# Altium project Fleet-Monitor.PrjPcb
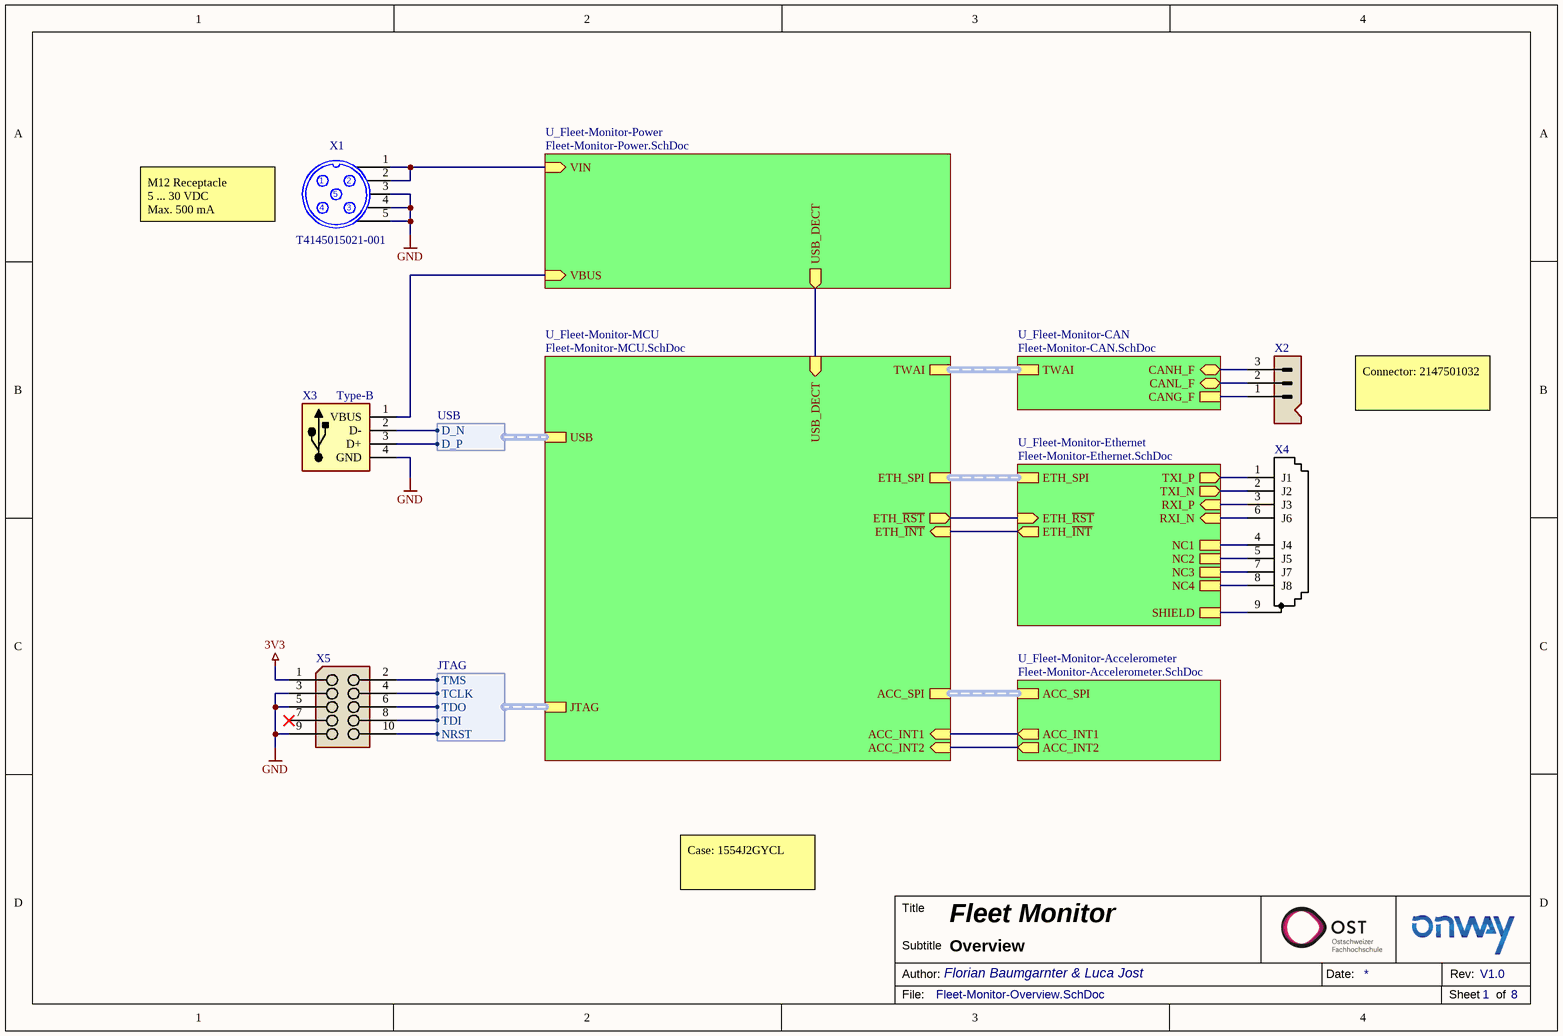
[diagram p0: Fleet-Monitor-Overview.SchDoc]
8 sheets, 116 parts. Net scope: hierarchical (ports join the sheet entries above them; power ports are global).
Sheets:
  Fleet-Monitor-Overview.SchDoc
    U_Fleet-Monitor-CAN = Fleet-Monitor-CAN.SchDoc
      U_Fleet-Monitor-CAN-Filter = Fleet-Monitor-CAN-Filter.SchDoc
    U_Fleet-Monitor-Ethernet = Fleet-Monitor-Ethernet.SchDoc
      U_Fleet-Monitor-Ethernet-Filter = Fleet-Monitor-Ethernet-Filter.SchDoc
    U_Fleet-Monitor-Accelerometer = Fleet-Monitor-Accelerometer.SchDoc
    U_Fleet-Monitor-Power = Fleet-Monitor-Power.SchDoc
    U_Fleet-Monitor-MCU = Fleet-Monitor-MCU.SchDoc

## Sheet Fleet-Monitor-Overview.SchDoc: Fleet Monitor
size A4; Subtitle: Overview; DocumentNumber: 1; Revision: V1.0; SheetNumber: 1; SheetTotal: 8; Author: Florian Baumgarnter & Luca Jost

### Parts
X1  T4145015021-001  [THT Connector M12]
X2  Pin Header Through Hole Wire To Board  [THT Connector 0436500315]  (value not drawn)
X3  Type-B  [THT Connector MUSBD111M5]
X4  NE8FDH-C5E-TOP  [THT Connector NE8FDH-C5E-TOP]  (value not drawn)
X5  JTAG-Header (ARM-Cortex)  [SMD Connector 1.27mm (2x5)]  (value not drawn)

### Sub-sheets
U_Fleet-Monitor-Accelerometer = Fleet-Monitor-Accelerometer.SchDoc: ACC_SPI (harness SPI), ACC_INT1 (out), ACC_INT2 (out)
U_Fleet-Monitor-CAN = Fleet-Monitor-CAN.SchDoc: TWAI (harness TWAI), CANH_F (bidir), CANL_F (bidir), CANG_F
U_Fleet-Monitor-Ethernet = Fleet-Monitor-Ethernet.SchDoc: NC1, ETH_SPI (harness SPI), TXI_P (out), TXI_N (out), RXI_P (in), RXI_N (in), ETH_~{RST} (in), ETH_~{INT} (out), NC2, NC3, NC4, SHIELD
U_Fleet-Monitor-MCU = Fleet-Monitor-MCU.SchDoc: USB (harness USB), JTAG (harness JTAG), ETH_SPI (harness SPI), TWAI (harness TWAI), ACC_INT1 (in), ACC_INT2 (in), ETH_~{RST} (out), ETH_~{INT} (in), ACC_SPI (harness SPI), USB_DECT (in)
U_Fleet-Monitor-Power = Fleet-Monitor-Power.SchDoc: VBUS (in), VIN (in), USB_DECT (out)

### Harnesses
JTAG: TMS, TDI, TDO, TCLK, NRST
USB: D_P, D_N

### Nets
3V3: X5.1
CAN_GND: X2.1 ; sheet U_Fleet-Monitor-CAN/CANG_F
EGND: X4.9 ; sheet U_Fleet-Monitor-Ethernet/SHIELD
GND: X1.3 X1.4 X1.5 X3.4(GND) X5.3 X5.5 X5.9
ACC_INT1: sheet U_Fleet-Monitor-Accelerometer/ACC_INT1, sheet U_Fleet-Monitor-MCU/ACC_INT1
ACC_INT2: sheet U_Fleet-Monitor-Accelerometer/ACC_INT2, sheet U_Fleet-Monitor-MCU/ACC_INT2
ETH_~{INT}: sheet U_Fleet-Monitor-Ethernet/ETH_~{INT}, sheet U_Fleet-Monitor-MCU/ETH_~{INT}
ETH_~{RST}: sheet U_Fleet-Monitor-Ethernet/ETH_~{RST}, sheet U_Fleet-Monitor-MCU/ETH_~{RST}
JTAG_NRST: X5.10 ; sheet U_Fleet-Monitor-MCU/JTAG.NRST
JTAG_TCLK: X5.4 ; sheet U_Fleet-Monitor-MCU/JTAG.TCLK
JTAG_TDI: X5.8 ; sheet U_Fleet-Monitor-MCU/JTAG.TDI
JTAG_TDO: X5.6 ; sheet U_Fleet-Monitor-MCU/JTAG.TDO
JTAG_TMS: X5.2 ; sheet U_Fleet-Monitor-MCU/JTAG.TMS
RXI_N: X4.6 ; sheet U_Fleet-Monitor-Ethernet/RXI_N
RXI_P: X4.3 ; sheet U_Fleet-Monitor-Ethernet/RXI_P
TXI_N: X4.2 ; sheet U_Fleet-Monitor-Ethernet/TXI_N
TXI_P: X4.1 ; sheet U_Fleet-Monitor-Ethernet/TXI_P
USB_D_N: X3.2(D-) ; sheet U_Fleet-Monitor-MCU/USB.D_N
USB_D_P: X3.3(D+) ; sheet U_Fleet-Monitor-MCU/USB.D_P
NetC5_2: X2.2 ; sheet U_Fleet-Monitor-CAN/CANL_F
NetC6_2: X2.3 ; sheet U_Fleet-Monitor-CAN/CANH_F
NetF1_1: X1.1 X1.2 ; sheet U_Fleet-Monitor-Power/VIN
NetF2_1: X3.1(VBUS) ; sheet U_Fleet-Monitor-Power/VBUS
NetR15_1: X4.4 ; sheet U_Fleet-Monitor-Ethernet/NC1
NetR17_1: X4.5 ; sheet U_Fleet-Monitor-Ethernet/NC2
NetR21_1: X4.7 ; sheet U_Fleet-Monitor-Ethernet/NC3
NetR23_1: X4.8 ; sheet U_Fleet-Monitor-Ethernet/NC4
NetR27_6: sheet U_Fleet-Monitor-Power/USB_DECT, sheet U_Fleet-Monitor-MCU/USB_DECT

Not connected (* = marked no-connect by the designer): X5 7*

### Buses and harness runs
harness sheet U_Fleet-Monitor-Accelerometer/ACC_SPI = sheet U_Fleet-Monitor-MCU/ACC_SPI
harness sheet U_Fleet-Monitor-CAN/TWAI = sheet U_Fleet-Monitor-MCU/TWAI
harness sheet U_Fleet-Monitor-Ethernet/ETH_SPI = sheet U_Fleet-Monitor-MCU/ETH_SPI

### Notes on the sheet
- M12 Receptacle
  5 ... 30 VDC
  Max. 500 mA
- Connector: 2147501032
- Case: 1554J2GYCL
- Title
- Author:
- Subtitle
- Date:
- Rev:
- File:
- Sheet
- of
- (in symbol NE8FDH-C5E-TOP) J1; J2; J3; J6; J4; J5; J7; J8

### Library data of the parts
X1 = T4145015021: M12 Receptacle Connector PCB Assembly; ComponentLink1Description: Datasheet; ComponentLink1URL: https://www.te.com/commerce/DocumentDelivery/DDEController?Action=srchrtrv&DocNm=T41450150X1001&DocType=Customer+Drawing&DocLang=English; Component Value: T4145015021-001; Digikey: A126521-ND; Unit Price: 6.97; Component Description: M12 Receptacle Connector PCB Assembly
X2 = X-Stiftleiste (3-Fach): Component Value: 436500315; Digikey: WM1918-ND; Farnell: 1654451; Mouser: 538-43650-0315; Unit Price: 0.38; ComponentLink1Description: Datasheet; ComponentLink1URL: https://datasheet.lcsc.com/lcsc/1912111437_MOLEX-436500315_C293546.pdf; JLC-Parts: C293546; Component Description: Pin Header Through Hole Wire To Board
X3 = X-USB-Buchse: Typ-B; Component Value: MUSBD111M5; Digikey: MUSBD111M5-ND; Farnell: 3728524; Mouser: 523-MUSBD111M5; Unit Price: 11.17; ComponentLink1Description: Datasheet; ComponentLink1URL: https://www.amphenol-icc.com/media/wysiwyg/files/drawing/musbd111xx.pdf; Component Description: USB-Buchse
X4 = NE8FDH-C5E-TOP: RJ45 etherCON IP65; Component Value: NE8FDH-C5E-TOP; Farnell: 3014323; Mouser: 568-NE8FDH-C5E-TOP; Unit Price: 12.83; ComponentLink1Description: Datasheet; ComponentLink1URL: https://www.mouser.ch/datasheet/2/289/ne8fdh_c5e_top-1853139.pdf; Component Description: RJ45 etherCON IP65
X5 = X-JTAG-Header (ARM-Cortex): Component Value: SHF-105-01-L-D-SM (2x5); Digikey: SAM10710-ND; Farnell: 1885915; Mouser: 200-SHF10501LDSM; Unit Price: 2.89; ComponentLink1Description: Datasheet; ComponentLink1URL: https://datasheet.lcsc.com/lcsc/1810170717_UNI-ROYAL-Uniroyal-Elec-4D03WGJ0331T5E_C12018.pdf; Component Description: JTAG-Header (ARM-Cortex)

## Sheet Fleet-Monitor-CAN.SchDoc: Fleet Monitor
size A4; Subtitle: CAN Isolator; DocumentNumber: 4; Revision: V1.0; SheetNumber: 4; SheetTotal: 8; Author: Florian Baumgartner & Luca Jost
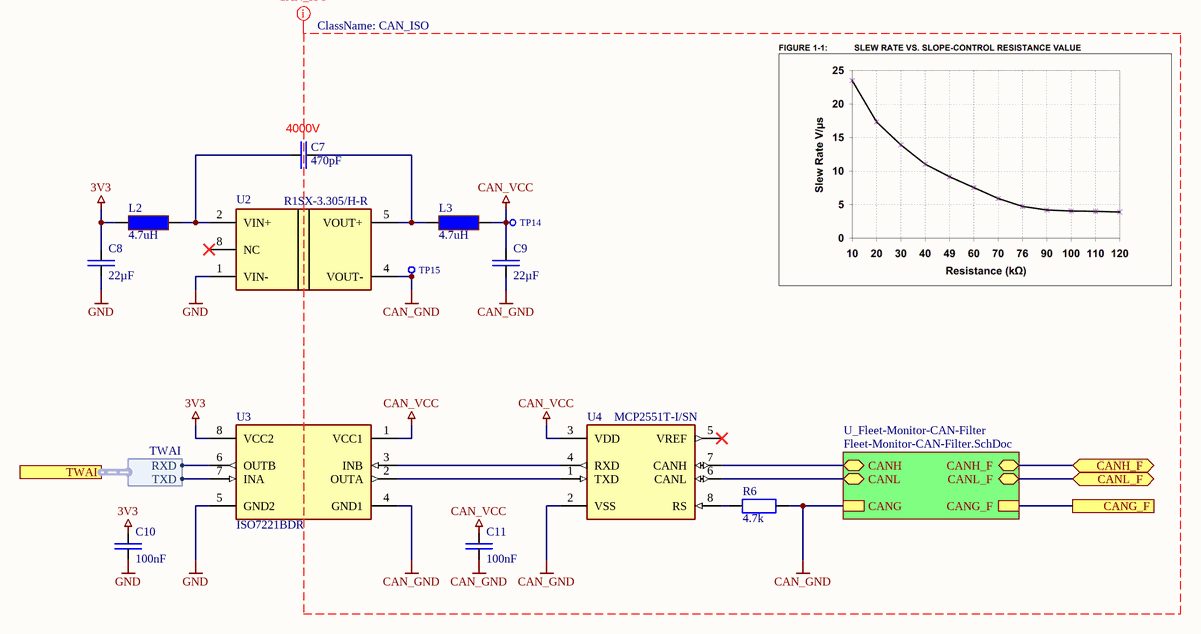
[diagram p1: Fleet-Monitor-CAN.SchDoc]

### Parts
C7  470pF  [SMD Keramikkondensator 1808]
C8  22µF  [SMD Keramikkondensator 0603]
C9  22µF  [SMD Keramikkondensator 0603]
C10  100nF  [SMD Keramikkondensator 0603]
C11  100nF  [SMD Keramikkondensator 0603]
L2  4.7uH  [SMD INDUCTOR/FERRITE 0805]
L3  4.7uH  [SMD INDUCTOR/FERRITE 0805]
R6  4.7k  [SMD Widerstand 0603]
TP14  X-TP  [SMD Testpunkt Ø1mm]  (value not drawn)  (no BOM)
TP15  X-TP  [SMD Testpunkt Ø1mm]  (value not drawn)  (no BOM)
U2  R1SX-3.305/H-R  [SMD DCDC R1SX]
U3  ISO7221BDR  [SMD IC SOIC-8]
U4  MCP2551T-I/SN  [SMD IC SOIC-8]

### Sub-sheets
U_Fleet-Monitor-CAN-Filter = Fleet-Monitor-CAN-Filter.SchDoc: CANH (bidir), CANL (bidir), CANG, CANH_F (bidir), CANL_F (bidir), CANG_F

### Ports
CANG_F, CANH_F (bidir), CANL_F (bidir), TWAI (harness TWAI)

### Harnesses
TWAI: TXD, RXD

### Nets
3V3: C8.2 C10.2 L2.1 U3.8(VCC2)
CAN_GND: C9.1 C11.1 R6.2 TP15.1 U2.4(VOUT-) U3.4(GND1) U4.2(VSS) ; port CANG_F, sheet U_Fleet-Monitor-CAN-Filter/CANG, sheet U_Fleet-Monitor-CAN-Filter/CANG_F
CAN_VCC: C9.2 C11.2 L3.2 TP14.1 U3.1(VCC1) U4.3(VDD)
GND: C8.1 C10.1 U2.1(VIN-) U3.5(GND2)
TWAI_RXD: U3.6(OUTB) ; port TWAI.RXD
TWAI_TXD: U3.7(INA) ; port TWAI.TXD
NetC5_2: port CANL_F, sheet U_Fleet-Monitor-CAN-Filter/CANL_F
NetC6_2: port CANH_F, sheet U_Fleet-Monitor-CAN-Filter/CANH_F
NetC7_1: C7.1 L2.2 U2.2(VIN+)
NetC7_2: C7.2 L3.1 U2.5(VOUT+)
NetL1_1: U4.6(CANL) ; sheet U_Fleet-Monitor-CAN-Filter/CANL
NetL1_4: U4.7(CANH) ; sheet U_Fleet-Monitor-CAN-Filter/CANH
NetR6_1: R6.1 U4.8(RS)
NetU3_2: U3.2(OUTA) U4.1(TXD)
NetU3_3: U3.3(INB) U4.4(RXD)

Not connected (* = marked no-connect by the designer): U2 8(NC)*; U4 5(VREF)*

### Layout directives
net class CAN_ISO: CAN_GND, CAN_VCC

### Notes on the sheet
- (near C7) 4000V
- Title
- Author:
- Subtitle
- Date:
- Rev:
- File:
- Sheet
- of

### Library data of the parts
C7 = E6 - 470pF: SMD Ceramic Capacitor E6; Component Value: 470pF 3kV; Component Description: Multilayer Ceramic Capacitors MLCC; ComponentLink1Description: Datasheet; ComponentLink1URL: https://datasheet.lcsc.com/lcsc/1810201242_IHHEC-HOLY-STONE-ENTERPRISE-CO.,-LTD-C1808X471K302T_C106130.pdf; Digikey: 732-12100-1-ND; Farnell: 2812607; JLC-Parts: C106130; Mouser: 710-885342210003; Unit Price: 0.11
C8 C9 = E6 - 22uF: SMD Ceramic Capacitor E6; Component Value: 22µF 25V; Component Description: Multilayer Ceramic Capacitors MLCC; ComponentLink1Description: Datasheet; ComponentLink1URL: https://datasheet.lcsc.com/lcsc/1811151152_Samsung-Electro-Mechanics-CL21A226MAQNNNE_C45783.pdf; Digikey: 1276-2908-1-ND; Farnell: 3013459; JLC-Parts: C45783; Mouser: 187-CL21A226MAQNNNE; Unit Price: 0.04
C10 C11 = E6 - 100nF: SMD Ceramic Capacitor E6; Component Value: 100nF 50V; Component Description: Multilayer Ceramic Capacitors MLCC; ComponentLink1Description: Datasheet; ComponentLink1URL: https://datasheet.lcsc.com/lcsc/1809301912_YAGEO-CC0603KRX7R9BB104_C14663.pdf; Digikey: 445-6899-1-ND; Farnell: 2210822; JLC-Parts: C14663; Mouser: 810-CGA2B3X7R1H104K; Unit Price: 0.01
L2 L3 = MLP2012V4R7MT0S1: 0805 Inductor 4.7uH; Component Description: Power Inductor; ComponentLink1Description: Datasheet; ComponentLink1URL: https://datasheet.lcsc.com/lcsc/1810241416_Murata-Electronics-LQM2MPN4R7MG0L_C86094.pdf; Component Value: 4.7uH; Digikey: 490-12073-1-ND; Farnell: 2840129; JLC-Parts: C86094; Mouser: 81-LQM2MPN4R7MG0L; Unit Price: 0.09
R6 = E24 - 4.7k: SMD Chip Resistor E24; Component Value: 4.7k (75V, 100mW, 1%); ComponentLink1Description: Datasheet; ComponentLink1URL: https://datasheet.lcsc.com/lcsc/1810200710_UNI-ROYAL-Uniroyal-Elec-0603WAF4701T5E_C23162.pdf; Digikey: P4.70KHCT-ND; Farnell: 2303181; JLC-Parts: C23162; Mouser: 667-ERJ-3EKF4701V; Unit Price: 0.01; Component Description: Chip Resistor
TP14 TP15 = X-TP: Testpunkt; Component Value: Ø 0.8mm; Component Description: Testpoint; Unit Price: 0.00
U2 = R1SX-3.305/H-R: Isolated Module DC DC Converter 1 Output 5V - - - 200mA 2.97V - 3.63V Input; Component Description: Isolated DC-DC-Converter; ComponentLink1Description: Datasheet; ComponentLink1URL: https://recom-power.com/pdf/Econoline/R1SX.pdf; Digikey: 945-3197-1-ND; Component Value: R1SX-3.305/H-R; Mouser: 919-R1SX-3.305/H-R; Unit Price: 3.94
U3 = ISO7221BDR: General Purpose Digital Isolator 2500Vrms 2 Channel 5Mbps 25kV/µs CMTI 8-SOIC (0.154", 3.90mm Width); Component Description: Unidirectional Digital Isolator; ComponentLink1Description: Datasheet; ComponentLink1URL: https://www.ti.com/lit/ds/symlink/iso7220a.pdf?HQS=dis-dk-null-digikeymode-dsf-pf-null-wwe&ts=1633476815997; Digikey: 296-38965-2-ND; Component Value: ISO7221BDR; JLC-Parts: C138522; Mouser: 595-ISO7221BDR; Unit Price: 2.94
U4 = MCP2551T-I/SN: High-Speed CAN Transceiver; Component Description: CAN Transceiver 1Mbps; Digikey: MCP2551T-I/SNTR-ND; ComponentLink1Description: Datasheet; ComponentLink1URL: https://ww1.microchip.com/downloads/en/DeviceDoc/20001667G.pdf; Component Value: MCP2551T-I/SN; Farnell: 2763381; JLC-Parts: C49558; Mouser: 579-MCP2551T-I/SN; Unit Price: 1.04

## Sheet Fleet-Monitor-CAN-Filter.SchDoc: Fleet Monitor
size A4; Subtitle: CAN Filter; DocumentNumber: 3; Revision: V1.0; SheetNumber: 5; SheetTotal: 8; Author: Florian Baumgartner & Luca Jost
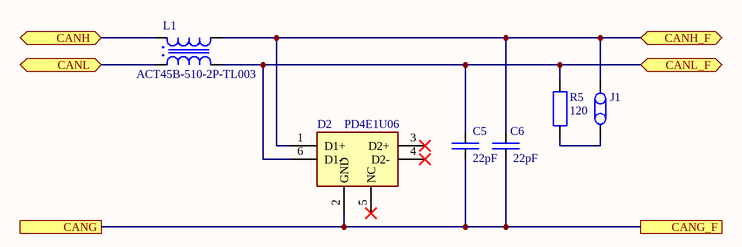
[diagram p2: Fleet-Monitor-CAN-Filter.SchDoc]

### Parts
C5  22pF  [SMD Keramikkondensator 0603]
C6  22pF  [SMD Keramikkondensator 0603]
D2  PD4E1U06  [SMD IC SOT-363 (SC-70-6)]
J1  X-Jumper (2 Fach)  [THT  Jumper]  (value not drawn)
L1  ACT45B-510-2P-TL003  [SMD Common Mode Choke 4.5x3.2]
R5  120  [SMD Widerstand 0603]

### Ports
CANG, CANG_F, CANH (bidir), CANH_F (bidir), CANL (bidir), CANL_F (bidir)

### Nets
CAN_GND: C5.1 C6.1 D2.2(GND) ; port CANG, port CANG_F
NetC5_2: C5.2 D2.6(D1-) L1.2 R5.2 ; port CANL_F
NetC6_2: C6.2 D2.1(D1+) J1.2 L1.3 ; port CANH_F
NetJ1_1: J1.1 R5.1
NetL1_1: L1.1 ; port CANL
NetL1_4: L1.4 ; port CANH

Not connected (* = marked no-connect by the designer): D2 3(D2+)* 4(D2-)* 5(NC)*

### Notes on the sheet
- Title
- Author:
- Subtitle
- Date:
- Rev:
- File:
- Sheet
- of

### Library data of the parts
C5 C6 = E6 - 22pF: SMD Ceramic Capacitor E6; Component Value: 22pF 50V; Component Description: Multilayer Ceramic Capacitors MLCC; ComponentLink1Description: Datasheet; ComponentLink1URL: https://datasheet.lcsc.com/lcsc/1810121815_Samsung-Electro-Mechanics-CL10C220JB8NNNC_C1653.pdf; Digikey: 1276-1023-1-ND; Farnell: 2332643; JLC-Parts: C1653; Mouser: 187-CL10C220JB8NNNC; Unit Price: 0.01
D2 = PD4E1U06DCKR: Unidirectional 3A (8/20us) 15V (Typ) 6.5V 5.5V (Max) SOT-363 ESD Protection Devices ROHS; Component Description: ESD Suppressor; ComponentLink1Description: Datasheet; ComponentLink1URL: https://datasheet.lcsc.com/lcsc/1810172210_Texas-Instruments-TPD4E1U06DCKR_C194628.pdf; Component Value: PD4E1U06; Digikey: 296-39347-1-ND; Farnell: 3116516; JLC-Parts: C194628; Mouser: 595-TPD4E1U06DCKR; Unit Price: 0.12
J1 = X-Jumper (2 Fach): Component Value: 2-Pol; Component Description: Through Hole Jumper; Digikey: WM50016-02-ND; Farnell: 2668454; Mouser: 538-22-28-4023; Unit Price: 0.01; ComponentLink1Description: Datasheet; ComponentLink1URL: https://datasheet.lcsc.com/lcsc/1912111437_PINREX-210-91-02GB01_C390678.pdf; JLC-Parts: C358684
L1 = ACT45B-510-2P-TL003: 51uH @ 100kHz 2.8kΩ @ 10MHz 50V 1Ω Signal Line 4532 Common Mode Filters ROHS; Component Value: ACT45B-101-2P-TL003; ComponentLink1Description: Datasheet; ComponentLink1URL: https://datasheet.lcsc.com/lcsc/1811151538_TDK-ACT45B-101-2P-TL003_C88056.pdf; Digikey: 445-3959-1-ND; Farnell: 3407556; JLC-Parts: C88056; Mouser: 810-ACT45B1012PTL003; Unit Price: 0.56; Component Description: Common Mode Filter
R5 = E24 - 120: SMD Chip Resistor E24; Component Value: 120 (75V, 100mW, 1%); ComponentLink1Description: Datasheet; ComponentLink1URL: https://datasheet.lcsc.com/lcsc/1810200710_UNI-ROYAL-Uniroyal-Elec-0603WAF4701T5E_C23162.pdf; Digikey: P120HCT-ND; Farnell: 2303067; JLC-Parts: C22787; Mouser: 667-ERJ-3EKF1200V; Unit Price: 0.01; Component Description: Chip Resistor

## Sheet Fleet-Monitor-Ethernet.SchDoc: Fleet Monitor
size A4; Subtitle: Ethernet Interface; DocumentNumber: 5; Revision: V1.0; SheetNumber: 6; SheetTotal: 8; Author: Florian Baumgartner & Luca Jost
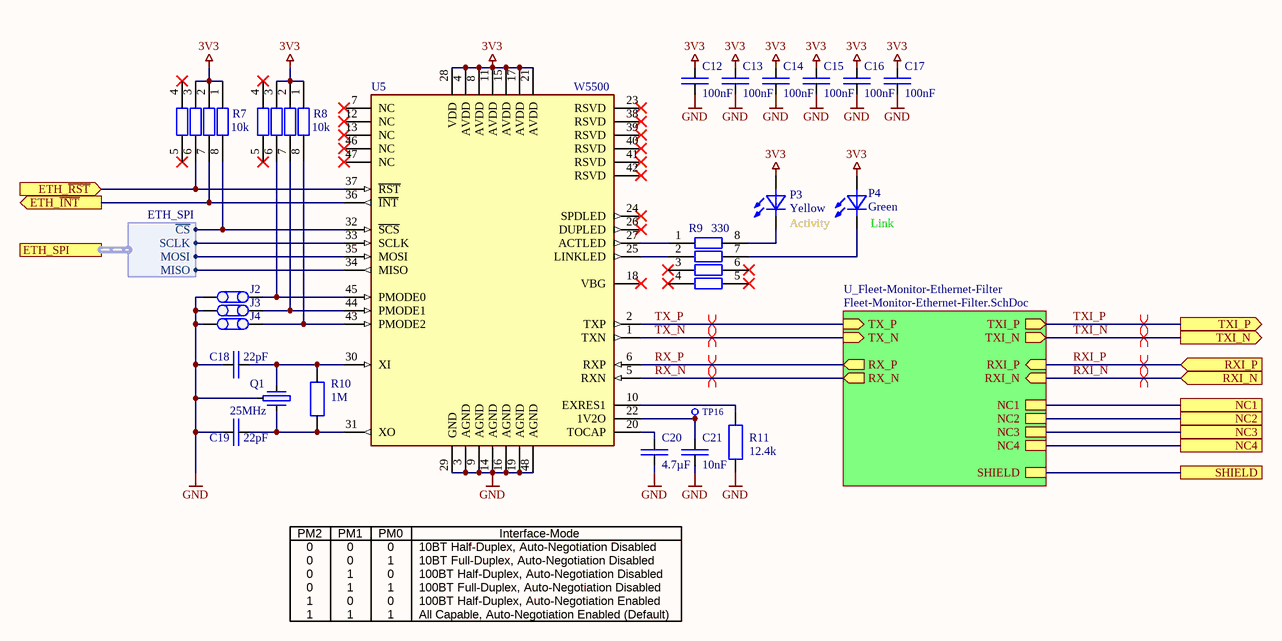
[diagram p3: Fleet-Monitor-Ethernet.SchDoc]

### Parts
C12  100nF  [SMD Keramikkondensator 0603]
C13  100nF  [SMD Keramikkondensator 0603]
C14  100nF  [SMD Keramikkondensator 0603]
C15  100nF  [SMD Keramikkondensator 0603]
C16  100nF  [SMD Keramikkondensator 0603]
C17  100nF  [SMD Keramikkondensator 0603]
C18  22pF  [SMD Keramikkondensator 0603]
C19  22pF  [SMD Keramikkondensator 0603]
C20  4.7µF  [SMD Keramikkondensator 0603]
C21  10nF  [SMD Keramikkondensator 0603]
J2  X-Jumper (2 Fach)  [SMD Solder Jumper 1x2mm]  (value not drawn)
J3  X-Jumper (2 Fach)  [SMD Solder Jumper 1x2mm]  (value not drawn)
J4  X-Jumper (2 Fach)  [SMD Solder Jumper 1x2mm]  (value not drawn)
P3  Yellow  [SMD LED 0603]
P4  Green  [SMD LED 0603]
Q1  25MHz  [SMD Crystal 2520]
R7  10k  [SMD Widerstand Array 4-Fach 0603]
R8  10k  [SMD Widerstand Array 4-Fach 0603]
R9  330  [SMD Widerstand Array 4-Fach 0603]
R10  1M  [SMD Widerstand 0603]
R11  12.4k  [SMD Widerstand 0603]
TP16  X-TP  [SMD Testpunkt Ø1mm]  (value not drawn)  (no BOM)
U5  W5500  [SMD IC LQFP-48]

### Sub-sheets
U_Fleet-Monitor-Ethernet-Filter = Fleet-Monitor-Ethernet-Filter.SchDoc: TXI_P (out), TXI_N (out), RXI_P (in), RXI_N (in), TX_P (in), TX_N (in), RX_P (out), RX_N (out), NC1, NC2, NC3, NC4, SHIELD

### Ports
ETH_SPI (harness ETH_SPI), ETH_~{INT} (out), ETH_~{RST} (in), NC1, NC2, NC3, NC4, RXI_N (in), RXI_P (in), SHIELD, TXI_N (out), TXI_P (out)

### Harnesses
ETH_SPI: ~{CS}, MOSI, MISO, SCLK

### Nets
3V3: C12.2 C13.2 C14.2 C15.2 C16.2 C17.2 P3.A P4.A R7.1 R7.2 R7.3 R8.1 R8.2 R8.3 U5.4(AVDD) U5.8(AVDD) U5.11(AVDD) U5.15(AVDD) U5.17(AVDD) U5.21(AVDD) U5.28(VDD)
EGND: port SHIELD, sheet U_Fleet-Monitor-Ethernet-Filter/SHIELD
GND: C12.1 C13.1 C14.1 C15.1 C16.1 C17.1 C18.2 C19.2 C20.1 C21.1 J2.1 J3.1 J4.1 Q1.3 R11.1 U5.3(AGND) U5.9(AGND) U5.14(AGND) U5.16(AGND) U5.19(AGND) U5.29(GND) U5.48(AGND)
ETH_~{CS}: R7.8 U5.32(~{SCS}) ; port ETH_SPI.~{CS}
ETH_~{INT}: R7.7 U5.36(~{INT}) ; port ETH_~{INT}
ETH_MISO: U5.34(MISO) ; port ETH_SPI.MISO
ETH_MOSI: U5.35(MOSI) ; port ETH_SPI.MOSI
ETH_~{RST}: R7.6 U5.37(~{RST}) ; port ETH_~{RST}
ETH_SCLK: U5.33(SCLK) ; port ETH_SPI.SCLK
RX_N: U5.5(RXN) ; sheet U_Fleet-Monitor-Ethernet-Filter/RX_N
RX_P: U5.6(RXP) ; sheet U_Fleet-Monitor-Ethernet-Filter/RX_P
RXI_N: port RXI_N, sheet U_Fleet-Monitor-Ethernet-Filter/RXI_N
RXI_P: port RXI_P, sheet U_Fleet-Monitor-Ethernet-Filter/RXI_P
TX_N: U5.1(TXN) ; sheet U_Fleet-Monitor-Ethernet-Filter/TX_N
TX_P: U5.2(TXP) ; sheet U_Fleet-Monitor-Ethernet-Filter/TX_P
TXI_N: port TXI_N, sheet U_Fleet-Monitor-Ethernet-Filter/TXI_N
TXI_P: port TXI_P, sheet U_Fleet-Monitor-Ethernet-Filter/TXI_P
NetC18_1: C18.1 Q1.1 R10.1 U5.30(XI)
NetC19_1: C19.1 Q1.2 R10.2 U5.31(XO)
NetC20_2: C20.2 U5.20(TOCAP)
NetC21_2: C21.2 TP16.1 U5.22(1V2O)
NetJ2_2: J2.2 R8.6 U5.45(PMODE0)
NetJ3_2: J3.2 R8.7 U5.44(PMODE1)
NetJ4_2: J4.2 R8.8 U5.43(PMODE2)
NetP3_K: P3.K R9.8
NetP4_K: P4.K R9.7
NetR9_1: R9.1 U5.27(ACTLED)
NetR9_2: R9.2 U5.25(LINKLED)
NetR11_2: R11.2 U5.10(EXRES1)
NetR15_1: port NC1, sheet U_Fleet-Monitor-Ethernet-Filter/NC1
NetR17_1: port NC2, sheet U_Fleet-Monitor-Ethernet-Filter/NC2
NetR21_1: port NC3, sheet U_Fleet-Monitor-Ethernet-Filter/NC3
NetR23_1: port NC4, sheet U_Fleet-Monitor-Ethernet-Filter/NC4

Not connected (* = marked no-connect by the designer): R7 4* 5*; R8 4* 5*; R9 3* 4* 5* 6*; U5 7(NC)* 12(NC)* 13(NC)* 18(VBG)* 23(RSVD)* 24(SPDLED)* 26(DUPLED)* 38(RSVD)* 39(RSVD)* 40(RSVD)* 41(RSVD)* 42(RSVD)* 46(NC)* 47(NC)*

### Layout directives
differential pair: RX_N, RX_P, RXI_N, RXI_P, TX_N, TX_P, TXI_N, TXI_P

### Notes on the sheet
- Activity
- (near P4) Link
- PM2
- 0
- PM1
- 1
- PM0
- 10BT Half-Duplex, Auto-Negotiation Disabled
- 10BT Full-Duplex, Auto-Negotiation Disabled
- 100BT Half-Duplex, Auto-Negotiation Disabled
- Interface-Mode
- 100BT Full-Duplex, Auto-Negotiation Disabled
- 100BT Half-Duplex, Auto-Negotiation Enabled
- All Capable, Auto-Negotiation Enabled (Default)
- Title
- Author:
- Subtitle
- Date:
- Rev:
- File:
- Sheet
- of

### Library data of the parts
C12-C17 = E6 - 100nF: as C10 on sheet Fleet-Monitor-CAN; ComponentLink1Description: Datasheet; ComponentLink1URL: https://datasheet.lcsc.com/lcsc/1809301912_YAGEO-CC0603KRX7R9BB104_C14663.pdf; Digikey: 445-6899-1-ND; Farnell: 2210822; JLC-Parts: C14663; Mouser: 810-CGA2B3X7R1H104K; Unit Price: 0.01
C18 C19 = E6 - 22pF: as C5 on sheet Fleet-Monitor-CAN-Filter; ComponentLink1Description: Datasheet; ComponentLink1URL: https://datasheet.lcsc.com/lcsc/1810121815_Samsung-Electro-Mechanics-CL10C220JB8NNNC_C1653.pdf; Digikey: 1276-1023-1-ND; Farnell: 2332643; JLC-Parts: C1653; Mouser: 187-CL10C220JB8NNNC; Unit Price: 0.01
C20 = E6 - 4.7uF: SMD Ceramic Capacitor E6; Component Value: 4.7µF 16V; Component Description: Multilayer Ceramic Capacitors MLCC; ComponentLink1Description: Datasheet; ComponentLink1URL: https://datasheet.lcsc.com/lcsc/1810261514_Samsung-Electro-Mechanics-CL10A475KO8NNNC_C19666.pdf; Digikey: 1276-1784-1-ND; Farnell: 3013397; JLC-Parts: C19666; Mouser: 187-CL10A475KO8NNNC; Unit Price: 0.01
C21 = E6 - 10nF: SMD Ceramic Capacitor E6; Component Value: 10nF 50V; Component Description: Multilayer Ceramic Capacitors MLCC; ComponentLink1Description: Datasheet; ComponentLink1URL: https://datasheet.lcsc.com/lcsc/2102081402_FH-Guangdong-Fenghua-Advanced-Tech-0603B103K500NT_C57112.pdf; Digikey: 478-3700-1-ND; Farnell: 1833876; JLC-Parts: C57112; Mouser: 581-06031C103J; Unit Price: 0.01
J2-J4 = X-Jumper (2 Fach): Component Value: 2-Pol; Component Description: Solder Jumper; Unit Price: 0.00
P3 = LED Yellow 0603: General Purpose LED; Component Value: Yellow (5mA, 2.0V); Digikey: 350-2032-1-ND; Farnell: 1465989; Mouser: 645-598-8040-107F; Unit Price: 0.34; ComponentLink1Description: Datasheet; ComponentLink1URL: https://datasheet.lcsc.com/szlcsc/Everlight-Elec-19-217-GHC-YR1S2-3T_C72043.pdf; JLC-Parts: C72038; Component Description: General Purpose LED
P4 = LED Green 0603: General Purpose LED; Component Value: Green (5mA, 2.4V); Digikey: 350-2035-1-ND; Farnell: 1465991; Mouser: 645-598-8070-107F; Unit Price: 0.34; ComponentLink1Description: Datasheet; ComponentLink1URL: https://datasheet.lcsc.com/szlcsc/Everlight-Elec-19-217-GHC-YR1S2-3T_C72043.pdf; JLC-Parts: C72043; Component Description: General Purpose LED
Q1 = Crystal 25MHz 7E25000E20UCG: SMD Crystal Resonators 25MHz 10ppm -40℃~85℃; ComponentLink1Description: Datasheet; ComponentLink1URL: https://datasheet.lcsc.com/lcsc/1810170940_SJK-SHENZHEN-CRYSTAL-TECH-7E25000E20UCG_C252264.pdf; Component Value: 25MHz; Digikey: XC3050CT-ND; Farnell: 3649710; JLC-Parts: C252264; Mouser: 520-250-10-36B-CTNT; Unit Price: 0.14; Component Description: Crystal
R7 R8 = R-Array Single Quad E24 - 10k: Isolated Resistor Array; Component Value: 10k (4x, 50V, 62.5mW, 5%); ComponentLink1Description: Datasheet; ComponentLink1URL: https://datasheet.lcsc.com/lcsc/1810191515_UNI-ROYAL-Uniroyal-Elec-4D03WGJ0103T5E_C29718.pdf; Digikey: Y4103CT-ND; Farnell: 2060167; JLC-Parts: C29718; Mouser: 667-EXB-V8V103JV; Unit Price: 0.01; Component Description: Isolated Resistor Array
R9 = R-Array Single Quad E24 - 330: Isolated Resistor Array; Component Value: 330 (4x, 50V, 62.5mW, 5%); ComponentLink1Description: Datasheet; ComponentLink1URL: https://datasheet.lcsc.com/lcsc/1810170717_UNI-ROYAL-Uniroyal-Elec-4D03WGJ0331T5E_C12018.pdf; Digikey: Y4331CT-ND; Farnell: 2060160; JLC-Parts: C12018; Mouser: 667-EXB-V8V331JV; Unit Price: 0.01; Component Description: Isolated Resistor Array
R10 = E96 - 1M: SMD Chip Resistor E24; Component Value: 1M (75V, 100mW, 1%); ComponentLink1Description: Datasheet; ComponentLink1URL: https://datasheet.lcsc.com/lcsc/1810200710_UNI-ROYAL-Uniroyal-Elec-0603WAF4701T5E_C23162.pdf; Digikey: P1.00MHCT-ND; Farnell: 2303325; JLC-Parts: C22935; Mouser: 667-ERJ-3EKF1004V; Unit Price: 0.01; Component Description: Chip Resistor
R11 = E96 - 12.4k: SMD Chip Resistor E96; Component Value: 12.4k (75V, 100mW, 1%); ComponentLink1Description: Datasheet; ComponentLink1URL: https://datasheet.lcsc.com/lcsc/1810170234_PANASONIC-ERJ3EKF1242V_C194071.pdf; Digikey: P12.4KHCT-ND; Farnell: 2059414; JLC-Parts: C194071; Mouser: 667-ERJ-3EKF1242V; Unit Price: 0.01; Component Description: Chip Resistor
TP16 = X-TP: as TP14 on sheet Fleet-Monitor-CAN; Unit Price: 0.00
U5 = W5500: Ethernet Controller 10/100 Base-T/TX PHY SPI Interface 48-LQFP (7x7); ComponentLink1Description: Datasheet; ComponentLink1URL: http://wizwiki.net/wiki/lib/exe/fetch.php?media=products:w5500:w5500_ds_v108e.pdf; Digikey: 1278-W5500TR-ND; Component Value: W5500; JLC-Parts: C32843; Mouser: 950-W5500; Unit Price: 3.76; Component Description: Ethernet Controller

## Sheet Fleet-Monitor-Ethernet-Filter.SchDoc: Fleet Monitor
size A4; Subtitle: Ethernet Isolator; DocumentNumber: 6; Revision: V1.0; SheetNumber: 7; SheetTotal: 8; Author: Florian Baumgartner & Luca Jost
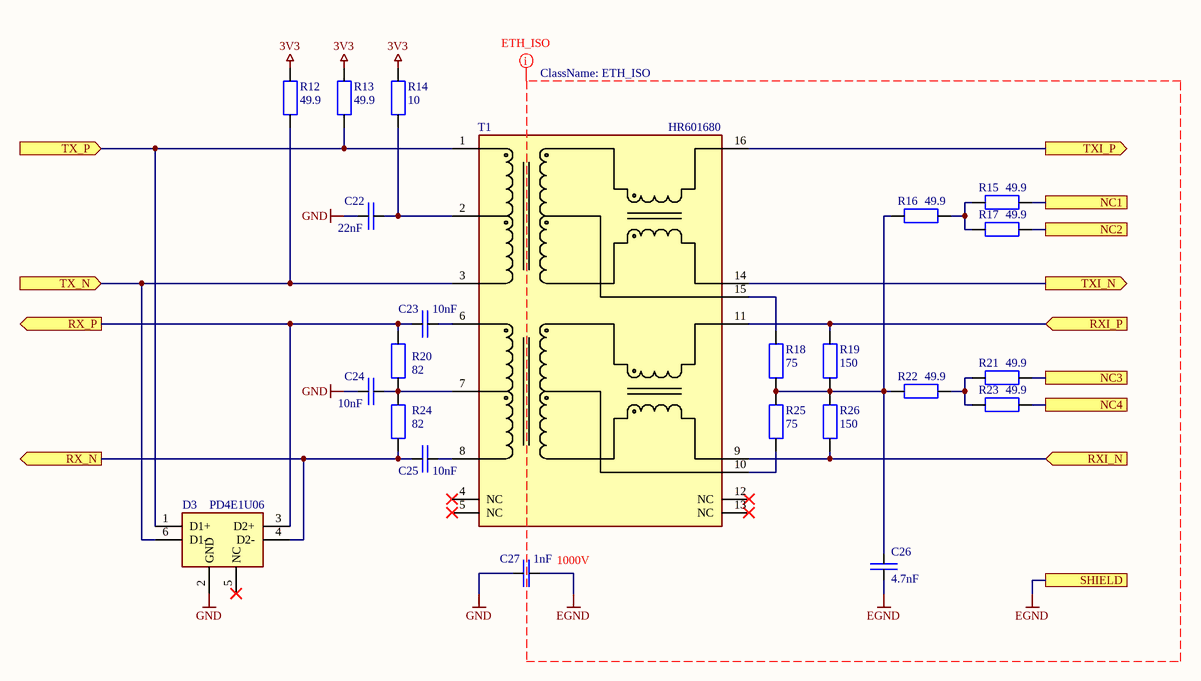
[diagram p4: Fleet-Monitor-Ethernet-Filter.SchDoc]

### Parts
C22  22nF  [SMD Keramikkondensator 0603]
C23  10nF  [SMD Keramikkondensator 0603]
C24  10nF  [SMD Keramikkondensator 0603]
C25  10nF  [SMD Keramikkondensator 0603]
C26  4.7nF  [SMD Keramikkondensator 0603]
C27  1nF  [SMD Keramikkondensator 1808]
D3  PD4E1U06  [SMD IC SOT-363 (SC-70-6)]
R12  49.9  [SMD Widerstand 0603]
R13  49.9  [SMD Widerstand 0603]
R14  10  [SMD Widerstand 0603]
R15  49.9  [SMD Widerstand 0603]
R16  49.9  [SMD Widerstand 0603]
R17  49.9  [SMD Widerstand 0603]
R18  75  [SMD Widerstand 0603]
R19  150  [SMD Widerstand 0603]
R20  82  [SMD Widerstand 0603]
R21  49.9  [SMD Widerstand 0603]
R22  49.9  [SMD Widerstand 0603]
R23  49.9  [SMD Widerstand 0603]
R24  82  [SMD Widerstand 0603]
R25  75  [SMD Widerstand 0603]
R26  150  [SMD Widerstand 0603]
T1  HR601680  [SMD Transformer 500x375]

### Ports
NC1, NC2, NC3, NC4, RX_N (out), RX_P (out), RXI_N (in), RXI_P (in), SHIELD, TX_N (in), TX_P (in), TXI_N (out), TXI_P (out)

### Nets
3V3: R12.2 R13.2 R14.2
EGND: C26.1 C27.2 ; port SHIELD
GND: C22.2 C24.2 C27.1 D3.2(GND)
RX_N: C25.1 D3.4(D2-) R24.1 ; port RX_N
RX_P: C23.1 D3.3(D2+) R20.2 ; port RX_P
RXI_N: R26.1 T1.9(RX-) ; port RXI_N
RXI_P: R19.2 T1.11(RX+) ; port RXI_P
TX_N: D3.6(D1-) R12.1 T1.3(TD-) ; port TX_N
TX_P: D3.1(D1+) R13.1 T1.1(TD+) ; port TX_P
TXI_N: T1.14(TX-) ; port TXI_N
TXI_P: T1.16(TX+) ; port TXI_P
NetC22_1: C22.1 R14.1 T1.2(CT)
NetC23_2: C23.2 T1.6(RD+)
NetC24_1: C24.1 R20.1 R24.2 T1.7(CT)
NetC25_2: C25.2 T1.8(RD-)
NetC26_2: C26.2 R16.2 R18.1 R19.1 R22.2 R25.2 R26.2
NetR15_1: R15.1 ; port NC1
NetR15_2: R15.2 R16.1 R17.2
NetR17_1: R17.1 ; port NC2
NetR18_2: R18.2 T1.15(NC)
NetR21_1: R21.1 ; port NC3
NetR21_2: R21.2 R22.1 R23.2
NetR23_1: R23.1 ; port NC4
NetR25_1: R25.1 T1.10(NC)

Not connected (* = marked no-connect by the designer): D3 5(NC)*; T1 4(NC)* 5(NC)* 12(NC)* 13(NC)*

### Layout directives
net class ETH_ISO: EGND

### Notes on the sheet
- 1000V
- Title
- Author:
- Subtitle
- Date:
- Rev:
- File:
- Sheet
- of

### Library data of the parts
C22 = E6 - 22nF: SMD Ceramic Capacitor E6; Component Value: 22nF 50V; Description: Multilayer Ceramic Capacitors MLCC; ComponentLink1Description: Datasheet; ComponentLink1URL: https://datasheet.lcsc.com/lcsc/1811101610_Samsung-Electro-Mechanics-CL10B223KB8NNNC_C21122.pdf; Digikey: 1276-1104-1-ND; Farnell: 3013425; JLC-Parts: C21122; Mouser: 187-CL10B223KB8NNNC; Unit Price: 0.01; Component Description: Multilayer Ceramic Capacitors MLCC
C23-C25 = E6 - 10nF: SMD Ceramic Capacitor E6; Component Value: 10nF 50V; Description: Multilayer Ceramic Capacitors MLCC; ComponentLink1Description: Datasheet; ComponentLink1URL: https://datasheet.lcsc.com/lcsc/2102081402_FH-Guangdong-Fenghua-Advanced-Tech-0603B103K500NT_C57112.pdf; Digikey: 478-3700-1-ND; Farnell: 1833876; JLC-Parts: C57112; Mouser: 581-06031C103J; Unit Price: 0.01; Component Description: Multilayer Ceramic Capacitors MLCC
C26 = E6 - 4.7nF: SMD Ceramic Capacitor E6; Component Value: 4.7nF 50V; Description: Multilayer Ceramic Capacitors MLCC; ComponentLink1Description: Datasheet; ComponentLink1URL: https://datasheet.lcsc.com/lcsc/1811061811_FH-Guangdong-Fenghua-Advanced-Tech-0603B472K500NT_C53987.pdf; Digikey: 478-10355-1-ND; Farnell: 2332650; JLC-Parts: C53987; Mouser: 581-06035C472JAT2A; Unit Price: 0.01; Component Description: Multilayer Ceramic Capacitors MLCC
C27 = E6 - 1nF: SMD Ceramic Capacitor E6; Component Value: 1nF 3kV; Description: Multilayer Ceramic Capacitors MLCC; ComponentLink1Description: Datasheet; ComponentLink1URL: https://datasheet.lcsc.com/lcsc/1912111437_Johanson-Dielectrics-302R29W102KV4E_C173224.pdf; Digikey: 709-1047-1-ND; Farnell: 1886070; JLC-Parts: C173224; Mouser: 605-302R29W102KV4E; Unit Price: 0.06; Component Description: Multilayer Ceramic Capacitors MLCC
D3 = PD4E1U06DCKR: Unidirectional 3A (8/20us) 15V (Typ) 6.5V 5.5V (Max) SOT-363 ESD Protection Devices ROHS; Description: ESD Suppressor; ComponentLink1Description: Datasheet; ComponentLink1URL: https://datasheet.lcsc.com/lcsc/1810172210_Texas-Instruments-TPD4E1U06DCKR_C194628.pdf; Component Value: PD4E1U06; Digikey: 296-39347-1-ND; Farnell: 3116516; JLC-Parts: C194628; Mouser: 595-TPD4E1U06DCKR; Unit Price: 0.12; Component Description: ESD Suppressor
R12 R13 R15-R17 R21-R23 = E96 - 49.9: SMD Chip Resistor E96; Component Value: 49.9 (75V, 100mW, 1%); Description: Chip Resistor; ComponentLink1Description: Datasheet; ComponentLink1URL: https://datasheet.lcsc.com/lcsc/1810200710_UNI-ROYAL-Uniroyal-Elec-0603WAF4701T5E_C23162.pdf; Digikey: P49.9HCT-ND; Farnell: 2059274; JLC-Parts: C23184; Mouser: 667-ERJ-3EKF49R9V; Unit Price: 0.01; Component Description: Chip Resistor
R14 = E24 - 10: SMD Chip Resistor E24; Component Value: 10 (75V, 100mW, 1%); Description: Chip Resistor; ComponentLink1Description: Datasheet; ComponentLink1URL: https://datasheet.lcsc.com/lcsc/1810200710_UNI-ROYAL-Uniroyal-Elec-0603WAF4701T5E_C23162.pdf; Digikey: P10.0HCT-ND; Farnell: 2302958; JLC-Parts: C22859; Mouser: 667-ERJ-3EKF10R0V; Unit Price: 0.01; Component Description: Chip Resistor
R18 R25 = E24 - 75: SMD Chip Resistor E24; Component Value: 75 (75V, 100mW, 1%); Description: Chip Resistor; ComponentLink1Description: Datasheet; ComponentLink1URL: https://datasheet.lcsc.com/lcsc/1810200710_UNI-ROYAL-Uniroyal-Elec-0603WAF4701T5E_C23162.pdf; Digikey: P75.0HCT-ND; Farnell: 2059282; JLC-Parts: C4275; Mouser: 667-ERJ-3EKF75R0V; Unit Price: 0.01; Component Description: Chip Resistor
R19 R26 = E24 - 150: SMD Chip Resistor E24; Component Value: 150 (75V, 100mW, 1%); Description: Chip Resistor; ComponentLink1Description: Datasheet; ComponentLink1URL: https://datasheet.lcsc.com/lcsc/1810200710_UNI-ROYAL-Uniroyal-Elec-0603WAF4701T5E_C23162.pdf; Digikey: P150HCT-ND; Farnell: 2303076; JLC-Parts: C22808; Mouser: 667-ERJ-3EKF1500V; Unit Price: 0.01; Component Description: Chip Resistor
R20 R24 = E24 - 82: SMD Chip Resistor E24; Component Value: 82 (75V, 100mW, 1%); Description: Chip Resistor; ComponentLink1Description: Datasheet; ComponentLink1URL: https://datasheet.lcsc.com/lcsc/1810200710_UNI-ROYAL-Uniroyal-Elec-0603WAF4701T5E_C23162.pdf; Digikey: P82.0HCT-ND; Farnell: 2303052; JLC-Parts: C23255; Mouser: 667-ERJ-3EKF82R0V; Unit Price: 0.01; Component Description: Chip Resistor
T1 = HR601680: LAN 10/100 Base-T Pulse Transformer 1CT:1CT Transmitter, 1CT:1CT Receiver Surface Mount; Component Description: RJ45 Transformer; ComponentLink1Description: Datasheet; ComponentLink1URL: https://datasheet.lcsc.com/lcsc/1810041709_HANRUN-Zhongshan-HanRun-Elec-HR601680_C172799.pdf; Component Value: HR601680; Digikey: SM13072APELCT-ND; Farnell: 2673883; JLC-Parts: C172799; Mouser: 652-SM13072APEL; Unit Price: 0.57

## Sheet Fleet-Monitor-Accelerometer.SchDoc: Fleet Monitor
size A4; Subtitle: Accelerometer; DocumentNumber: 8; Revision: V1.0; SheetNumber: 8; SheetTotal: 8; Author: Florian Baumgartner & Luca Jost
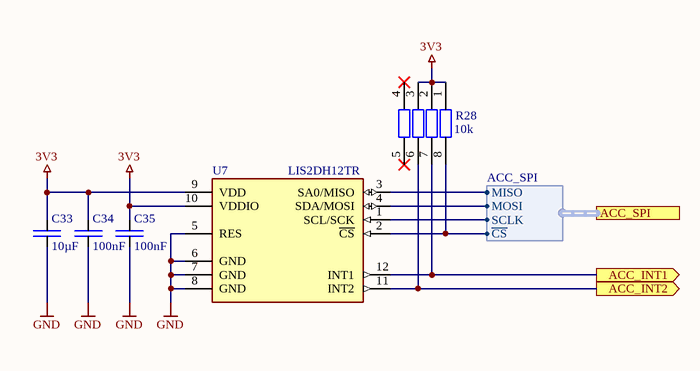
[diagram p5: Fleet-Monitor-Accelerometer.SchDoc]

### Parts
C33  10µF  [SMD Keramikkondensator 0603]
C34  100nF  [SMD Keramikkondensator 0603]
C35  100nF  [SMD Keramikkondensator 0603]
R28  10k  [SMD Widerstand Array 4-Fach 0603]
U7  LIS2DH12TR  [SMD IC LGA-12]

### Ports
ACC_INT1 (out), ACC_INT2 (out), ACC_SPI (harness ACC_SPI)

### Harnesses
ACC_SPI: SCLK, MOSI, MISO, ~{CS}

### Nets
3V3: C33.2 C34.2 C35.2 R28.1 R28.2 R28.3 U7.9(VDD) U7.10(VDDIO)
GND: C33.1 C34.1 C35.1 U7.5(RES) U7.6(GND) U7.7(GND) U7.8(GND)
ACC_~{CS}: R28.8 U7.2(~{CS}) ; port ACC_SPI.~{CS}
ACC_INT1: R28.7 U7.12(INT1) ; port ACC_INT1
ACC_INT2: R28.6 U7.11(INT2) ; port ACC_INT2
ACC_MISO: U7.3(SA0/MISO) ; port ACC_SPI.MISO
ACC_MOSI: U7.4(SDA/MOSI) ; port ACC_SPI.MOSI
ACC_SCLK: U7.1(SCL/SCK) ; port ACC_SPI.SCLK

Not connected (* = marked no-connect by the designer): R28 4* 5*

### Notes on the sheet
- Title
- Author:
- Subtitle
- Date:
- Rev:
- File:
- Sheet
- of

### Library data of the parts
C33 = E6 - 10uF: SMD Ceramic Capacitor E6; Component Value: 10µF 10V; Component Description: Multilayer Ceramic Capacitors MLCC; ComponentLink1Description: Datasheet; ComponentLink1URL: https://datasheet.lcsc.com/lcsc/1810191219_Samsung-Electro-Mechanics-CL10A106KP8NNNC_C19702.pdf; Digikey: 587-3258-1-ND; Farnell: 2113070; JLC-Parts: C19702; Mouser: 963-LMK107BBJ106MALT; Unit Price: 0.01
C34 C35 = E6 - 100nF: as C10 on sheet Fleet-Monitor-CAN; ComponentLink1Description: Datasheet; ComponentLink1URL: https://datasheet.lcsc.com/lcsc/1809301912_YAGEO-CC0603KRX7R9BB104_C14663.pdf; Digikey: 445-6899-1-ND; Farnell: 2210822; JLC-Parts: C14663; Mouser: 810-CGA2B3X7R1H104K; Unit Price: 0.01
R28 = R-Array Single Quad E24 - 10k: as R7 on sheet Fleet-Monitor-Ethernet; ComponentLink1Description: Datasheet; ComponentLink1URL: https://datasheet.lcsc.com/lcsc/1810191515_UNI-ROYAL-Uniroyal-Elec-4D03WGJ0103T5E_C29718.pdf; Digikey: Y4103CT-ND; Farnell: 2060167; JLC-Parts: C29718; Mouser: 667-EXB-V8V103JV; Unit Price: 0.01; Component Description: Isolated Resistor Array
U7 = LIS2DH12TR: Accelerometer X, Y, Z Axis ±2g, 4g, 8g, 16g 0.5Hz ~ 672Hz 12-LGA (2x2); Component Description: High-Performance 3-Xxis Accelerometer; ComponentLink1Description: Datasheet; ComponentLink1URL: https://www.st.com/content/ccc/resource/technical/document/datasheet/12/c0/5c/36/b9/58/46/f2/DM00091513.pdf/files/DM00091513.pdf/jcr:content/translations/en.DM00091513.pdf; Digikey: 497-14851-2-ND; Component Value: LIS2DH12TR; JLC-Parts: C110926; Mouser: 511-LIS2DH12TR; Unit Price: 0.87

## Sheet Fleet-Monitor-Power.SchDoc: Fleet Monitor
size A4; Subtitle: Power Distribution; DocumentNumber: 7; Revision: V1.0; SheetNumber: 2; SheetTotal: 8; Author: Florian Baumgartner & Luca Jost
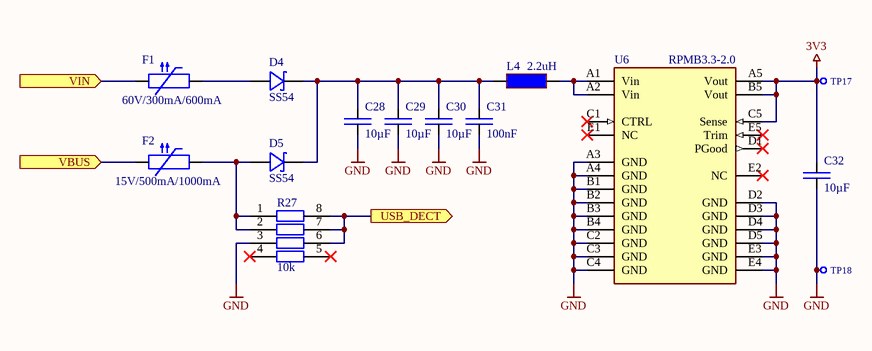
[diagram p6: Fleet-Monitor-Power.SchDoc]

### Parts
C28  10µF  [SMD Keramikkondensator 0805]
C29  10µF  [SMD Keramikkondensator 0805]
C30  10µF  [SMD Keramikkondensator 0805]
C31  100nF  [SMD Keramikkondensator 0603]
C32  10µF  [SMD Keramikkondensator 0603]
D4  SS54  [SMD Diode DO-214-AC]
D5  SS54  [SMD Diode DO-214-AC]
F1  60V/300mA/600mA  [SMD PPTC-Fuse 1812]
F2  15V/500mA/1000mA  [SMD PPTC-Fuse 1206]
L4  2.2uH  [SMD INDUCTOR/FERRITE 0805]
R27  10k  [SMD Widerstand Array 4-Fach 0603]
TP17  X-TP  [SMD Testpunkt Ø1mm]  (value not drawn)  (no BOM)
TP18  X-TP  [SMD Testpunkt Ø1mm]  (value not drawn)  (no BOM)
U6  RPMB3.3-2.0  [SMD DCDC RPM 2.0]

### Ports
USB_DECT (out), VBUS (in), VIN (in)

### Nets
3V3: C32.2 TP17.1 U6.A5(Vout) U6.B5(Vout) U6.C5(Sense)
GND: C28.1 C29.1 C30.1 C31.1 C32.1 R27.3 TP18.1 U6.A3(GND) U6.A4(GND) U6.B1(GND) U6.B2(GND) U6.B3(GND) U6.B4(GND) U6.C2(GND) U6.C3(GND) U6.C4(GND) U6.D2(GND) U6.D3(GND) U6.D4(GND) U6.D5(GND) U6.E3(GND) U6.E4(GND)
NetC28_2: C28.2 C29.2 C30.2 C31.2 D4.K D5.K L4.1
NetD4_A: D4.A F1.2
NetD5_A: D5.A F2.2 R27.1 R27.2
NetF1_1: F1.1 ; port VIN
NetF2_1: F2.1 ; port VBUS
NetL4_2: L4.2 U6.A1(Vin) U6.A2(Vin)
NetR27_6: R27.6 R27.7 R27.8 ; port USB_DECT

Not connected (* = marked no-connect by the designer): R27 4* 5*; U6 C1(CTRL)* D1(PGood)* E1(NC)* E2(NC)* E5(Trim)*

### Notes on the sheet
- Title
- Author:
- Subtitle
- Date:
- Rev:
- File:
- Sheet
- of

### Library data of the parts
C28-C30 = E6 - 10uF: SMD Ceramic Capacitor E6; Component Value: 10µF 50V; Component Description: Multilayer Ceramic Capacitors MLCC; ComponentLink1Description: Datasheet; ComponentLink1URL: https://datasheet.lcsc.com/lcsc/2004251506_Murata-Electronics-GRM21BR61H106KE43L_C440198.pdf; Digikey: 490-18663-1-ND; Farnell: 3790440; JLC-Parts: C440198; Mouser: 81-GRM21BR61H106KE3L; Unit Price: 0.13
C31 = E6 - 100nF: as C10 on sheet Fleet-Monitor-CAN; ComponentLink1Description: Datasheet; ComponentLink1URL: https://datasheet.lcsc.com/lcsc/1809301912_YAGEO-CC0603KRX7R9BB104_C14663.pdf; Digikey: 445-6899-1-ND; Farnell: 2210822; JLC-Parts: C14663; Mouser: 810-CGA2B3X7R1H104K; Unit Price: 0.01
C32 = E6 - 10uF: as C33 on sheet Fleet-Monitor-Accelerometer; ComponentLink1Description: Datasheet; ComponentLink1URL: https://datasheet.lcsc.com/lcsc/1810191219_Samsung-Electro-Mechanics-CL10A106KP8NNNC_C19702.pdf; Digikey: 587-3258-1-ND; Farnell: 2113070; JLC-Parts: C19702; Mouser: 963-LMK107BBJ106MALT; Unit Price: 0.01
D4 D5 = SS54: 40V 5A 550mV @ 5A SMA(DO-214AC) Schottky Barrier Diodes (SBD) ROHS; ComponentLink1Description: Datasheet; ComponentLink1URL: https://datasheet.lcsc.com/lcsc/1810192041_MDD%EF%BC%88Microdiode-Electronics%EF%BC%89-SS54_C22452.pdf; Component Value: SS54; Digikey: 641-SS54-HFCT-ND; Farnell: 1861427; JLC-Parts: C22452; Mouser: 750-SS54-HF; Unit Price: 0.10; Component Description: Schottky Barrier Diode
F1 = JK-nSMD010: 60V 250mA 1s 1206 Resettable Fuses; Component Value: 60V/300mA/600mA/100ms; Component Description: PTC Resettable Fuse; ComponentLink1Description: Datasheet; ComponentLink1URL: https://datasheet.lcsc.com/lcsc/1809211319_RUILON-Shenzhen-Ruilongyuan-Elec-SMD1812P030TF-60V_C117855.pdf; Digikey: F8131CT-ND; Farnell: 1961501; JLC-Parts: C117855; Mouser: 576-1812L035/60MR; Unit Price: 0.07
F2 = nSMD020-30V: 30V 460mA 1206 Resettable Fuses; Component Value: 15V/500mA/1000mA/100ms; Component Description: PTC Resettable Fuse; ComponentLink1Description: Datasheet; ComponentLink1URL: https://datasheet.lcsc.com/lcsc/1912111437_Littelfuse-1206L050-15YR-A_C315893.pdf; Digikey: F3733CT-ND; Farnell: 2752736; JLC-Parts: C315893; Mouser: 576-1206L050/15YR; Unit Price: 0.23
L4 = TFM201610GHM-2R2MTAA: Ferrite Bead 2.2uH 2.6A / 142mOhm; Component Description: Power Inductor; ComponentLink1Description: Datasheet; ComponentLink1URL: https://datasheet.lcsc.com/lcsc/1810061613_TDK-TFM201610GHM-2R2MTAA_C136243.pdf; Component Value: 2.2uH; Digikey: 445-173104-1-ND; Farnell: 2470314; JLC-Parts: C136243; Mouser: 810-TFM201610GHM2R2A; Unit Price: 0.13
R27 = R-Array Single Quad E24 - 10k: as R7 on sheet Fleet-Monitor-Ethernet; ComponentLink1Description: Datasheet; ComponentLink1URL: https://datasheet.lcsc.com/lcsc/1810191515_UNI-ROYAL-Uniroyal-Elec-4D03WGJ0103T5E_C29718.pdf; Digikey: Y4103CT-ND; Farnell: 2060167; JLC-Parts: C29718; Mouser: 667-EXB-V8V103JV; Unit Price: 0.01; Component Description: Isolated Resistor Array
TP17 TP18 = X-TP: as TP14 on sheet Fleet-Monitor-CAN; Unit Price: 0.00
U6 = RPMB3.3-2.0: Non-Isolated PoL Module DC DC Converter 1 Output 3.3V    2A 4V - 36V Input; Component Value: RPMB3.3-3.0; Component Description: DC-DC Stepdown Converter; ComponentLink1Description: Datasheet; ComponentLink1URL: https://recom-power.com/pdf/Innoline/RPMB-2.0.pdf; Digikey: 945-RPMB3.3-3.0CT-ND; Farnell: 3551809; Mouser: 919-RPMB3.3-3.0; Unit Price: 7.43

## Sheet Fleet-Monitor-MCU.SchDoc: Fleet Monitor
size A4; Subtitle: Microcontroller; DocumentNumber: 2; Revision: V1.0; SheetNumber: 3; SheetTotal: 8; Author: Florian Baumgartner & Luca Jost
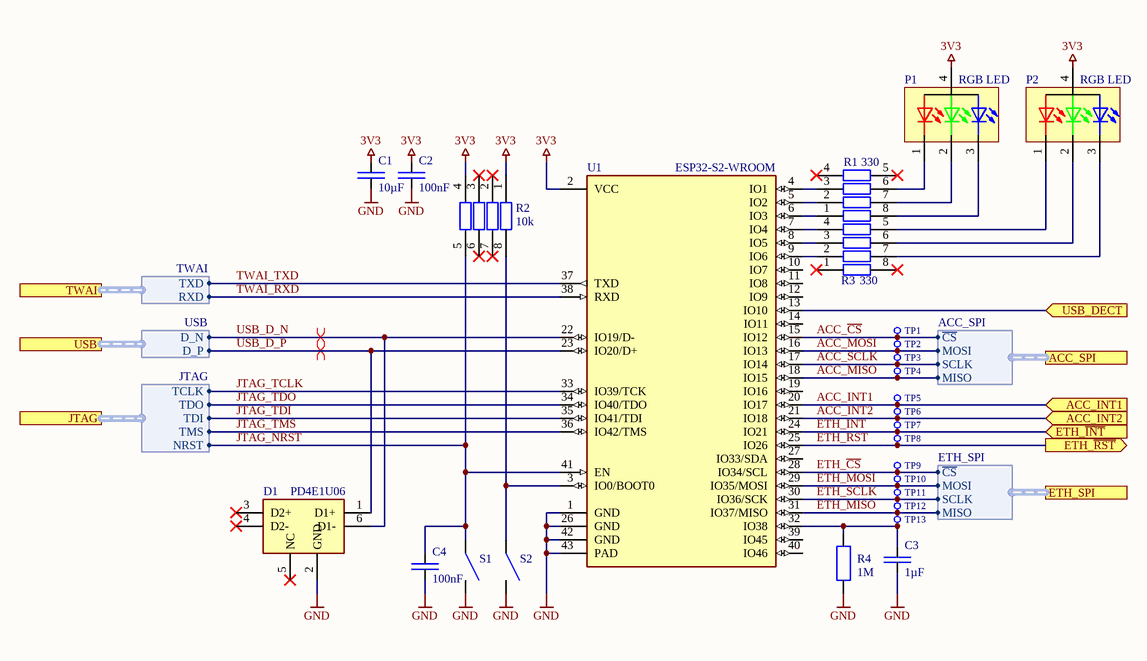
[diagram p7: Fleet-Monitor-MCU.SchDoc]

### Parts
C1  10µF  [SMD Keramikkondensator 0603]
C2  100nF  [SMD Keramikkondensator 0603]
C3  1µF  [SMD Keramikkondensator 0603]
C4  100nF  [SMD Keramikkondensator 0603]
D1  PD4E1U06  [SMD IC SOT-363 (SC-70-6)]
P1  RGB LED  [SMD LED PLCC-4]
P2  RGB LED  [SMD LED PLCC-4]
R1  330  [SMD Widerstand Array 4-Fach 0603]
R2  10k  [SMD Widerstand Array 4-Fach 0603]
R3  330  [SMD Widerstand Array 4-Fach 0603]
R4  1M  [SMD Widerstand 0603]
S1  SMD-Button  [SMD Button 5.2x5.2]  (value not drawn)
S2  SMD-Button  [SMD Button 5.2x5.2]  (value not drawn)
TP1  X-TP  [SMD Testpunkt Ø1mm]  (value not drawn)  (no BOM)
TP2  X-TP  [SMD Testpunkt Ø1mm]  (value not drawn)  (no BOM)
TP3  X-TP  [SMD Testpunkt Ø1mm]  (value not drawn)  (no BOM)
TP4  X-TP  [SMD Testpunkt Ø1mm]  (value not drawn)  (no BOM)
TP5  X-TP  [SMD Testpunkt Ø1mm]  (value not drawn)  (no BOM)
TP6  X-TP  [SMD Testpunkt Ø1mm]  (value not drawn)  (no BOM)
TP7  X-TP  [SMD Testpunkt Ø1mm]  (value not drawn)  (no BOM)
TP8  X-TP  [SMD Testpunkt Ø1mm]  (value not drawn)  (no BOM)
TP9  X-TP  [SMD Testpunkt Ø1mm]  (value not drawn)  (no BOM)
TP10  X-TP  [SMD Testpunkt Ø1mm]  (value not drawn)  (no BOM)
TP11  X-TP  [SMD Testpunkt Ø1mm]  (value not drawn)  (no BOM)
TP12  X-TP  [SMD Testpunkt Ø1mm]  (value not drawn)  (no BOM)
TP13  X-TP  [SMD Testpunkt Ø1mm]  (value not drawn)  (no BOM)
U1  ESP32-S2-WROOM  [SMD ESP32-S2-WROOM]

### Ports
ACC_INT1 (in), ACC_INT2 (in), ACC_SPI (harness ACC_SPI), ETH_SPI (harness ETH_SPI), ETH_~{INT} (in), ETH_~{RST} (out), JTAG (harness JTAG), TWAI (harness TWAI), USB (harness USB), USB_DECT (in)

### Harnesses
USB: D_P, D_N
JTAG: TMS, TDI, TDO, TCLK, NRST
ETH_SPI: SCLK, MOSI, MISO, ~{CS}
TWAI: TXD, RXD
ACC_SPI: SCLK, MOSI, MISO, ~{CS}

### Nets
3V3: C1.2 C2.2 P1.4 P2.4 R2.1 R2.4 U1.2(VCC)
GND: C1.1 C2.1 C3.1 C4.1 D1.2(GND) R4.2 S1.2 S2.2 U1.1(GND) U1.26(GND) U1.42(GND) U1.43(PAD)
ACC_~{CS}: TP1.1 U1.15(IO12) ; port ACC_SPI.~{CS}
ACC_INT1: TP5.1 U1.20(IO17) ; port ACC_INT1
ACC_INT2: TP6.1 U1.21(IO18) ; port ACC_INT2
ACC_MISO: TP4.1 U1.18(IO15) ; port ACC_SPI.MISO
ACC_MOSI: TP2.1 U1.16(IO13) ; port ACC_SPI.MOSI
ACC_SCLK: TP3.1 U1.17(IO14) ; port ACC_SPI.SCLK
ETH_~{CS}: TP9.1 U1.28(IO34/SCL) ; port ETH_SPI.~{CS}
ETH_~{INT}: TP7.1 U1.24(IO21) ; port ETH_~{INT}
ETH_MISO: TP12.1 U1.31(IO37/MISO) ; port ETH_SPI.MISO
ETH_MOSI: TP10.1 U1.29(IO35/MOSI) ; port ETH_SPI.MOSI
ETH_~{RST}: TP8.1 U1.25(IO26) ; port ETH_~{RST}
ETH_SCLK: TP11.1 U1.30(IO36/SCK) ; port ETH_SPI.SCLK
JTAG_NRST: C4.2 R2.5 S1.1 U1.41(EN) ; port JTAG.NRST
JTAG_TCLK: U1.33(IO39/TCK) ; port JTAG.TCLK
JTAG_TDI: U1.35(IO41/TDI) ; port JTAG.TDI
JTAG_TDO: U1.34(IO40/TDO) ; port JTAG.TDO
JTAG_TMS: U1.36(IO42/TMS) ; port JTAG.TMS
TWAI_RXD: U1.38(RXD) ; port TWAI.RXD
TWAI_TXD: U1.37(TXD) ; port TWAI.TXD
USB_D_N: D1.6(D1-) U1.22(IO19/D-) ; port USB.D_N
USB_D_P: D1.1(D1+) U1.23(IO20/D+) ; port USB.D_P
NetC3_2: C3.2 R4.1 TP13.1 U1.32(IO38)
NetP1_1: P1.1 R1.6
NetP1_2: P1.2 R1.7
NetP1_3: P1.3 R1.8
NetP2_1: P2.1 R3.5
NetP2_2: P2.2 R3.6
NetP2_3: P2.3 R3.7
NetR1_1: R1.1 U1.6(IO3)
NetR1_2: R1.2 U1.5(IO2)
NetR1_3: R1.3 U1.4(IO1)
NetR2_8: R2.8 S2.1 U1.3(IO0/BOOT0)
NetR3_2: R3.2 U1.9(IO6)
NetR3_3: R3.3 U1.8(IO5)
NetR3_4: R3.4 U1.7(IO4)
NetR27_6: U1.13(IO10) ; port USB_DECT

Not connected (* = marked no-connect by the designer): D1 3(D2+)* 4(D2-)* 5(NC)*; R1 4* 5*; R2 2* 3* 6* 7*; R3 1* 8*; U1 10(IO7) 11(IO8) 12(IO9) 14(IO11) 19(IO16) 27(IO33/SDA) 39(IO45) 40(IO46)

### Layout directives
differential pair: USB_D_N, USB_D_P

### Notes on the sheet
- Title
- Author:
- Subtitle
- Date:
- Rev:
- File:
- Sheet
- of

### Library data of the parts
C1 = E6 - 10uF: as C33 on sheet Fleet-Monitor-Accelerometer; ComponentLink1Description: Datasheet; ComponentLink1URL: https://datasheet.lcsc.com/lcsc/1810191219_Samsung-Electro-Mechanics-CL10A106KP8NNNC_C19702.pdf; Digikey: 587-3258-1-ND; Farnell: 2113070; JLC-Parts: C19702; Mouser: 963-LMK107BBJ106MALT; Unit Price: 0.01
C2 C4 = E6 - 100nF: as C10 on sheet Fleet-Monitor-CAN; ComponentLink1Description: Datasheet; ComponentLink1URL: https://datasheet.lcsc.com/lcsc/1809301912_YAGEO-CC0603KRX7R9BB104_C14663.pdf; Digikey: 445-6899-1-ND; Farnell: 2210822; JLC-Parts: C14663; Mouser: 810-CGA2B3X7R1H104K; Unit Price: 0.01
C3 = E6 - 1uF: SMD Ceramic Capacitor E6; Component Value: 1µF 50V; Component Description: Multilayer Ceramic Capacitors MLCC; ComponentLink1Description: Datasheet; ComponentLink1URL: https://datasheet.lcsc.com/lcsc/1810261812_Samsung-Electro-Mechanics-CL10A105KB8NNNC_C15849.pdf; Digikey: 1276-1860-1-ND; Farnell: 3013383; JLC-Parts: C15849; Mouser: 187-CL10A105KB8NNNC; Unit Price: 0.01
D1 = PD4E1U06DCKR: as D2 on sheet Fleet-Monitor-CAN-Filter; ComponentLink1Description: Datasheet; ComponentLink1URL: https://datasheet.lcsc.com/lcsc/1810172210_Texas-Instruments-TPD4E1U06DCKR_C194628.pdf; Component Value: PD4E1U06; Digikey: 296-39347-1-ND; Farnell: 3116516; JLC-Parts: C194628; Mouser: 595-TPD4E1U06DCKR; Unit Price: 0.12
P1 P2 = RGB LED: Component Value: 67-23/R6GHBHC-B01/2T; ComponentLink1Description: Datasheet; ComponentLink1URL: https://datasheet.lcsc.com/lcsc/2104061938_Everlight-Elec-67-23-R6GHBHC-B01-2T_C264607.pdf; Digikey: VAOS-SP4RGB4CT-ND; JLC-Parts: C264607; Mouser: 593-VAOS-SP4RGB4; Unit Price: 0.19; Component Description: RGB LED
R1 R3 = R-Array Single Quad E24 - 330: as R9 on sheet Fleet-Monitor-Ethernet; ComponentLink1Description: Datasheet; ComponentLink1URL: https://datasheet.lcsc.com/lcsc/1810170717_UNI-ROYAL-Uniroyal-Elec-4D03WGJ0331T5E_C12018.pdf; Digikey: Y4331CT-ND; Farnell: 2060160; JLC-Parts: C12018; Mouser: 667-EXB-V8V331JV; Unit Price: 0.01; Component Description: Isolated Resistor Array
R2 = R-Array Single Quad E24 - 10k: as R7 on sheet Fleet-Monitor-Ethernet; ComponentLink1Description: Datasheet; ComponentLink1URL: https://datasheet.lcsc.com/lcsc/1810191515_UNI-ROYAL-Uniroyal-Elec-4D03WGJ0103T5E_C29718.pdf; Digikey: Y4103CT-ND; Farnell: 2060167; JLC-Parts: C29718; Mouser: 667-EXB-V8V103JV; Unit Price: 0.01; Component Description: Isolated Resistor Array
R4 = E96 - 1M: as R10 on sheet Fleet-Monitor-Ethernet; ComponentLink1Description: Datasheet; ComponentLink1URL: https://datasheet.lcsc.com/lcsc/1810200710_UNI-ROYAL-Uniroyal-Elec-0603WAF4701T5E_C23162.pdf; Digikey: P1.00MHCT-ND; Farnell: 2303325; JLC-Parts: C22935; Mouser: 667-ERJ-3EKF1004V; Unit Price: 0.01; Component Description: Chip Resistor
S1 S2 = Button 3mmx2.5mm: Button SPST; Component Value: TS-1187A-B-A-B; Component Description: Tactile Switch; Digikey: CKN12221-1-ND; ComponentLink1Description: Datasheet; ComponentLink1URL: https://datasheet.lcsc.com/lcsc/2002271431_XKB-Connectivity-TS-1187A-B-A-B_C318884.pdf; Farnell: 3780596; JLC-Parts: C318884; Mouser: 611-PTS526SK15SMR2L; Unit Price: 0.02
TP1-TP13 = X-TP: as TP14 on sheet Fleet-Monitor-CAN; Unit Price: 0.00
U1 = ESP32-S2-WROOM: WiFi 802.11b/g/n Transceiver Module 2.4GHz Antenna, I-PEX Surface Mount; Component Description: Xtensa single-core 32-bit LX7 MCU; ComponentLink1Description: Datasheet; ComponentLink1URL: https://www.espressif.com/sites/default/files/documentation/esp32-s2-wroom_esp32-s2-wroom-i_datasheet_en.pdf; Digikey: 1965-ESP32-S2-WROOMTR-ND; Component Value: ESP32-S2-WROOM; JLC-Parts: C967026; Mouser: 356-ESP32S2WRMI320UH; Unit Price: 2.54

## Nets that join several sheets
3V3: Fleet-Monitor-Overview (X5.1), Fleet-Monitor-CAN (C8.2 C10.2 L2.1 U3.8), Fleet-Monitor-Ethernet (21 pins), Fleet-Monitor-Ethernet-Filter (R12.2 R13.2 R14.2), Fleet-Monitor-Accelerometer (8 pins), Fleet-Monitor-Power (5 pins), Fleet-Monitor-MCU (7 pins)
CAN_GND: Fleet-Monitor-Overview (X2.1), Fleet-Monitor-CAN (7 pins), Fleet-Monitor-CAN-Filter (C5.1 C6.1 D2.2)
EGND: Fleet-Monitor-Overview (X4.9), Fleet-Monitor-Ethernet-Filter (C26.1 C27.2)
GND: Fleet-Monitor-Overview (7 pins), Fleet-Monitor-CAN (C8.1 C10.1 U2.1 U3.5), Fleet-Monitor-Ethernet (22 pins), Fleet-Monitor-Ethernet-Filter (C22.2 C24.2 C27.1 D3.2), Fleet-Monitor-Accelerometer (7 pins), Fleet-Monitor-Power (22 pins), Fleet-Monitor-MCU (12 pins)
ACC_~{CS}: Fleet-Monitor-Accelerometer (R28.8 U7.2), Fleet-Monitor-MCU (TP1.1 U1.15)
ACC_INT1: Fleet-Monitor-Accelerometer (R28.7 U7.12), Fleet-Monitor-MCU (TP5.1 U1.20)
ACC_INT2: Fleet-Monitor-Accelerometer (R28.6 U7.11), Fleet-Monitor-MCU (TP6.1 U1.21)
ACC_MISO: Fleet-Monitor-Accelerometer (U7.3), Fleet-Monitor-MCU (TP4.1 U1.18)
ACC_MOSI: Fleet-Monitor-Accelerometer (U7.4), Fleet-Monitor-MCU (TP2.1 U1.16)
ACC_SCLK: Fleet-Monitor-Accelerometer (U7.1), Fleet-Monitor-MCU (TP3.1 U1.17)
ETH_~{CS}: Fleet-Monitor-Ethernet (R7.8 U5.32), Fleet-Monitor-MCU (TP9.1 U1.28)
ETH_~{INT}: Fleet-Monitor-Ethernet (R7.7 U5.36), Fleet-Monitor-MCU (TP7.1 U1.24)
ETH_MISO: Fleet-Monitor-Ethernet (U5.34), Fleet-Monitor-MCU (TP12.1 U1.31)
ETH_MOSI: Fleet-Monitor-Ethernet (U5.35), Fleet-Monitor-MCU (TP10.1 U1.29)
ETH_~{RST}: Fleet-Monitor-Ethernet (R7.6 U5.37), Fleet-Monitor-MCU (TP8.1 U1.25)
ETH_SCLK: Fleet-Monitor-Ethernet (U5.33), Fleet-Monitor-MCU (TP11.1 U1.30)
JTAG_NRST: Fleet-Monitor-Overview (X5.10), Fleet-Monitor-MCU (C4.2 R2.5 S1.1 U1.41)
JTAG_TCLK: Fleet-Monitor-Overview (X5.4), Fleet-Monitor-MCU (U1.33)
JTAG_TDI: Fleet-Monitor-Overview (X5.8), Fleet-Monitor-MCU (U1.35)
JTAG_TDO: Fleet-Monitor-Overview (X5.6), Fleet-Monitor-MCU (U1.34)
JTAG_TMS: Fleet-Monitor-Overview (X5.2), Fleet-Monitor-MCU (U1.36)
NetC5_2: Fleet-Monitor-Overview (X2.2), Fleet-Monitor-CAN-Filter (C5.2 D2.6 L1.2 R5.2)
NetC6_2: Fleet-Monitor-Overview (X2.3), Fleet-Monitor-CAN-Filter (C6.2 D2.1 J1.2 L1.3)
NetF1_1: Fleet-Monitor-Overview (X1.1 X1.2), Fleet-Monitor-Power (F1.1)
NetF2_1: Fleet-Monitor-Overview (X3.1), Fleet-Monitor-Power (F2.1)
NetL1_1: Fleet-Monitor-CAN (U4.6), Fleet-Monitor-CAN-Filter (L1.1)
NetL1_4: Fleet-Monitor-CAN (U4.7), Fleet-Monitor-CAN-Filter (L1.4)
NetR15_1: Fleet-Monitor-Overview (X4.4), Fleet-Monitor-Ethernet-Filter (R15.1)
NetR17_1: Fleet-Monitor-Overview (X4.5), Fleet-Monitor-Ethernet-Filter (R17.1)
NetR21_1: Fleet-Monitor-Overview (X4.7), Fleet-Monitor-Ethernet-Filter (R21.1)
NetR23_1: Fleet-Monitor-Overview (X4.8), Fleet-Monitor-Ethernet-Filter (R23.1)
NetR27_6: Fleet-Monitor-Power (R27.6 R27.7 R27.8), Fleet-Monitor-MCU (U1.13)
RX_N: Fleet-Monitor-Ethernet (U5.5), Fleet-Monitor-Ethernet-Filter (C25.1 D3.4 R24.1)
RX_P: Fleet-Monitor-Ethernet (U5.6), Fleet-Monitor-Ethernet-Filter (C23.1 D3.3 R20.2)
RXI_N: Fleet-Monitor-Overview (X4.6), Fleet-Monitor-Ethernet-Filter (R26.1 T1.9)
RXI_P: Fleet-Monitor-Overview (X4.3), Fleet-Monitor-Ethernet-Filter (R19.2 T1.11)
TWAI_RXD: Fleet-Monitor-CAN (U3.6), Fleet-Monitor-MCU (U1.38)
TWAI_TXD: Fleet-Monitor-CAN (U3.7), Fleet-Monitor-MCU (U1.37)
TX_N: Fleet-Monitor-Ethernet (U5.1), Fleet-Monitor-Ethernet-Filter (D3.6 R12.1 T1.3)
TX_P: Fleet-Monitor-Ethernet (U5.2), Fleet-Monitor-Ethernet-Filter (D3.1 R13.1 T1.1)
TXI_N: Fleet-Monitor-Overview (X4.2), Fleet-Monitor-Ethernet-Filter (T1.14)
TXI_P: Fleet-Monitor-Overview (X4.1), Fleet-Monitor-Ethernet-Filter (T1.16)
USB_D_N: Fleet-Monitor-Overview (X3.2), Fleet-Monitor-MCU (D1.6 U1.22)
USB_D_P: Fleet-Monitor-Overview (X3.3), Fleet-Monitor-MCU (D1.1 U1.23)